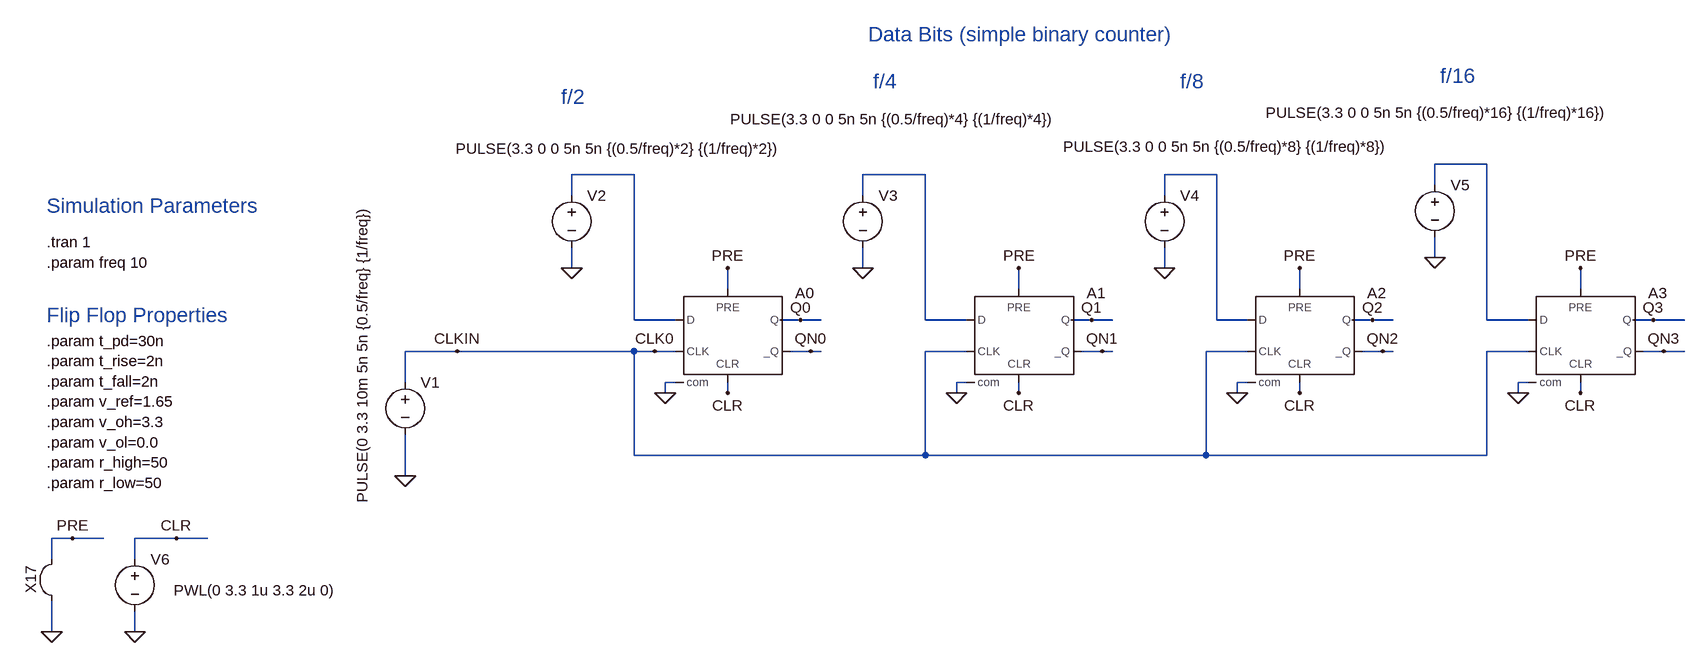
[diagram p0: schematic flip_flop_experimenter_parallel_latch.asc]
flip_flop_experimenter_parallel_latch.asc, the LTspice schematic file:
Version 4
SHEET 1 3364 680
WIRE 2496 -464 2416 -464
WIRE 1184 -448 1088 -448
WIRE 1632 -448 1536 -448
WIRE 2080 -448 2000 -448
WIRE 2416 -432 2416 -464
WIRE 1088 -416 1088 -448
WIRE 1536 -416 1536 -448
WIRE 2000 -416 2000 -448
WIRE 2416 -320 2416 -352
WIRE 1088 -304 1088 -336
WIRE 1536 -304 1536 -336
WIRE 2000 -304 2000 -336
WIRE 1328 -272 1328 -304
WIRE 1776 -272 1776 -304
WIRE 2208 -272 2208 -304
WIRE 2640 -272 2640 -304
WIRE 1184 -224 1184 -448
WIRE 1248 -224 1184 -224
WIRE 1440 -224 1408 -224
WIRE 1472 -224 1440 -224
WIRE 1632 -224 1632 -448
WIRE 1696 -224 1632 -224
WIRE 1888 -224 1856 -224
WIRE 1920 -224 1888 -224
WIRE 2080 -224 2080 -448
WIRE 2128 -224 2080 -224
WIRE 2320 -224 2288 -224
WIRE 2352 -224 2320 -224
WIRE 2496 -224 2496 -464
WIRE 2560 -224 2496 -224
WIRE 2752 -224 2720 -224
WIRE 2800 -224 2752 -224
WIRE 912 -176 832 -176
WIRE 1184 -176 912 -176
WIRE 1216 -176 1184 -176
WIRE 1248 -176 1216 -176
WIRE 1456 -176 1424 -176
WIRE 1472 -176 1456 -176
WIRE 1696 -176 1632 -176
WIRE 1904 -176 1872 -176
WIRE 1920 -176 1904 -176
WIRE 2128 -176 2064 -176
WIRE 2336 -176 2304 -176
WIRE 2352 -176 2336 -176
WIRE 2560 -176 2496 -176
WIRE 2768 -176 2736 -176
WIRE 2800 -176 2768 -176
WIRE 832 -128 832 -176
WIRE 1248 -128 1232 -128
WIRE 1696 -128 1680 -128
WIRE 2128 -128 2112 -128
WIRE 2560 -128 2544 -128
WIRE 1232 -112 1232 -128
WIRE 1328 -112 1328 -128
WIRE 1680 -112 1680 -128
WIRE 1776 -112 1776 -128
WIRE 2112 -112 2112 -128
WIRE 2208 -112 2208 -128
WIRE 2544 -112 2544 -128
WIRE 2640 -112 2640 -128
WIRE 1184 -16 1184 -176
WIRE 1632 -16 1632 -176
WIRE 1632 -16 1184 -16
WIRE 2064 -16 2064 -176
WIRE 2064 -16 1632 -16
WIRE 2496 -16 2496 -176
WIRE 2496 -16 2064 -16
WIRE 832 16 832 -48
WIRE 320 112 288 112
WIRE 368 112 320 112
WIRE 480 112 416 112
WIRE 528 112 480 112
WIRE 288 144 288 112
WIRE 416 144 416 112
WIRE 288 256 288 208
WIRE 416 256 416 224
FLAG 1232 -112 0
FLAG 832 16 0
FLAG 912 -176 CLKIN
FLAG 1216 -176 CLK0
FLAG 1440 -224 Q0
FLAG 1328 -112 CLR
FLAG 1328 -304 PRE
FLAG 1680 -112 0
FLAG 1888 -224 Q1
FLAG 1776 -112 CLR
FLAG 1776 -304 PRE
FLAG 2112 -112 0
FLAG 2320 -224 Q2
FLAG 2208 -112 CLR
FLAG 2208 -304 PRE
FLAG 2544 -112 0
FLAG 2752 -224 Q3
FLAG 2640 -112 CLR
FLAG 2640 -304 PRE
FLAG 1456 -176 QN0
FLAG 1904 -176 QN1
FLAG 2336 -176 QN2
FLAG 2768 -176 QN3
FLAG 1088 -304 0
FLAG 1536 -304 0
FLAG 2000 -304 0
FLAG 2416 -320 0
FLAG 288 256 0
FLAG 416 256 0
FLAG 320 112 PRE
FLAG 480 112 CLR
SYMBOL Digital\\dflop 1328 -272 R0
SYMATTR InstName A0
SYMATTR SpiceLine Vhigh {v_oh} Vlow {v_ol} Trise {t_rise} Tfall {t_fall} TD {t_pd} REF {v_ref}
SYMATTR SpiceLine2 rhigh {r_high} rlow {r_low}
SYMBOL voltage 832 -144 R0
WINDOW 123 0 0 Left 0
WINDOW 39 0 0 Left 0
WINDOW 3 -66 -259 VRight 2
SYMATTR InstName V1
SYMATTR Value PULSE(0 3.3 10m 5n 5n {0.5/freq} {1/freq})
SYMBOL Digital\\dflop 1776 -272 R0
SYMATTR InstName A1
SYMATTR SpiceLine Vhigh {v_oh} Vlow {v_ol} Trise {t_rise} Tfall {t_fall} TD {t_pd} REF {v_ref}
SYMATTR SpiceLine2 rhigh {r_high} rlow {r_low}
SYMBOL Digital\\dflop 2208 -272 R0
SYMATTR InstName A2
SYMATTR SpiceLine Vhigh {v_oh} Vlow {v_ol} Trise {t_rise} Tfall {t_fall} TD {t_pd} REF {v_ref}
SYMATTR SpiceLine2 rhigh {r_high} rlow {r_low}
SYMBOL Digital\\dflop 2640 -272 R0
SYMATTR InstName A3
SYMATTR SpiceLine Vhigh {v_oh} Vlow {v_ol} Trise {t_rise} Tfall {t_fall} TD {t_pd} REF {v_ref}
SYMATTR SpiceLine2 rhigh {r_high} rlow {r_low}
SYMBOL voltage 1088 -432 R0
WINDOW 123 0 0 Left 0
WINDOW 39 0 0 Left 0
WINDOW 3 327 -56 Right 2
SYMATTR InstName V2
SYMATTR Value PULSE(3.3 0 0 5n 5n {(0.5/freq)*2} {(1/freq)*2})
SYMBOL voltage 1536 -432 R0
WINDOW 123 0 0 Left 0
WINDOW 39 0 0 Left 0
WINDOW 3 -204 -101 Left 2
SYMATTR InstName V3
SYMATTR Value PULSE(3.3 0 0 5n 5n {(0.5/freq)*4} {(1/freq)*4})
SYMBOL voltage 2000 -432 R0
WINDOW 123 0 0 Left 0
WINDOW 39 0 0 Left 0
WINDOW 3 -156 -59 Left 2
SYMATTR InstName V4
SYMATTR Value PULSE(3.3 0 0 5n 5n {(0.5/freq)*8} {(1/freq)*8})
SYMBOL voltage 2416 -448 R0
WINDOW 123 0 0 Left 0
WINDOW 39 0 0 Left 0
WINDOW 3 -260 -95 Left 2
SYMATTR InstName V5
SYMATTR Value PULSE(3.3 0 0 5n 5n {(0.5/freq)*16} {(1/freq)*16})
SYMBOL Misc\\jumper 224 176 R270
SYMATTR InstName X17
SYMBOL voltage 416 128 R0
WINDOW 123 0 0 Left 0
WINDOW 39 0 0 Left 0
WINDOW 3 60 64 Left 2
SYMATTR InstName V6
SYMATTR Value PWL(0 3.3 1u 3.3 2u 0)
TEXT 280 -344 Left 2 !.tran 1\n.param freq 10
TEXT 280 -192 Left 2 !.param t_pd=30n\n.param t_rise=2n\n.param t_fall=2n\n.param v_ref=1.65\n.param v_oh=3.3\n.param v_ol=0.0\n.param r_high=50\n.param r_low=50
TEXT 280 -232 Left 3 ;Flip Flop Properties
TEXT 280 -400 Left 3 ;Simulation Parameters
TEXT 1072 -568 Left 3 ;f/2
TEXT 1552 -592 Left 3 ;f/4
TEXT 2024 -592 Left 3 ;f/8
TEXT 2424 -600 Left 3 ;f/16
TEXT 1544 -664 Left 3 ;Data Bits (simple binary counter)

The netlist it stands for:
* flip_flop_experimenter_parallel_latch.asc
A0 N002 0 CLK0 0 CLR QN0 Q0 0 DFLOP Vhigh {v_oh} Vlow {v_ol} Trise {t_rise} Tfall {t_fall} TD {t_pd} REF {v_ref} rhigh {r_high} rlow {r_low}
V1 CLK0 0 PULSE(0 3.3 10m 5n 5n {0.5/freq} {1/freq})
A1 N003 0 CLK0 0 CLR QN1 Q1 0 DFLOP Vhigh {v_oh} Vlow {v_ol} Trise {t_rise} Tfall {t_fall} TD {t_pd} REF {v_ref} rhigh {r_high} rlow {r_low}
A2 N004 0 CLK0 0 CLR QN2 Q2 0 DFLOP Vhigh {v_oh} Vlow {v_ol} Trise {t_rise} Tfall {t_fall} TD {t_pd} REF {v_ref} rhigh {r_high} rlow {r_low}
A3 N001 0 CLK0 0 CLR QN3 Q3 0 DFLOP Vhigh {v_oh} Vlow {v_ol} Trise {t_rise} Tfall {t_fall} TD {t_pd} REF {v_ref} rhigh {r_high} rlow {r_low}
V2 N002 0 PULSE(3.3 0 0 5n 5n {(0.5/freq)*2} {(1/freq)*2})
V3 N003 0 PULSE(3.3 0 0 5n 5n {(0.5/freq)*4} {(1/freq)*4})
V4 N004 0 PULSE(3.3 0 0 5n 5n {(0.5/freq)*8} {(1/freq)*8})
V5 N001 0 PULSE(3.3 0 0 5n 5n {(0.5/freq)*16} {(1/freq)*16})
V6 CLR 0 PWL(0 3.3 1u 3.3 2u 0)
.tran 1
.param freq 10
.param t_pd=30n
.param t_rise=2n
.param t_fall=2n
.param v_ref=1.65
.param v_oh=3.3
.param v_ol=0.0
.param r_high=50
.param r_low=50
* Flip Flop Properties
* Simulation Parameters
* f/2
* f/4
* f/8
* f/16
* Data Bits (simple binary counter)
.backanno
.end